# Altium schematic sheet FPGA_NonIO.SchDoc: FPGA Power and Programming
size A4; Organization: Altium Limited.; Address1: Level 3, 12a Rodborough Rd; Address2: Frenchs Forest 2086; Address3: NSW; Address4: AUSTRALIA; DocumentNumber: 7; SheetNumber: 7; SheetTotal: 21; PageSetup: Record=PageOptions|CenterHorizontal=True|CenterVertical=True|PrintScale=0.97|XCorrection=1.00|YCorrection=1.00|PrintKind=2|BorderSize=5000000|LeftOffset=0|BottomOffset=0|Orientation=2|PaperLength=1000|PaperWidth=1000|Scale=100|PaperSource=15|PrintQuality=600|MediaType=1|DitherType=10|PaperKind=A4|PrintScaleMode=1
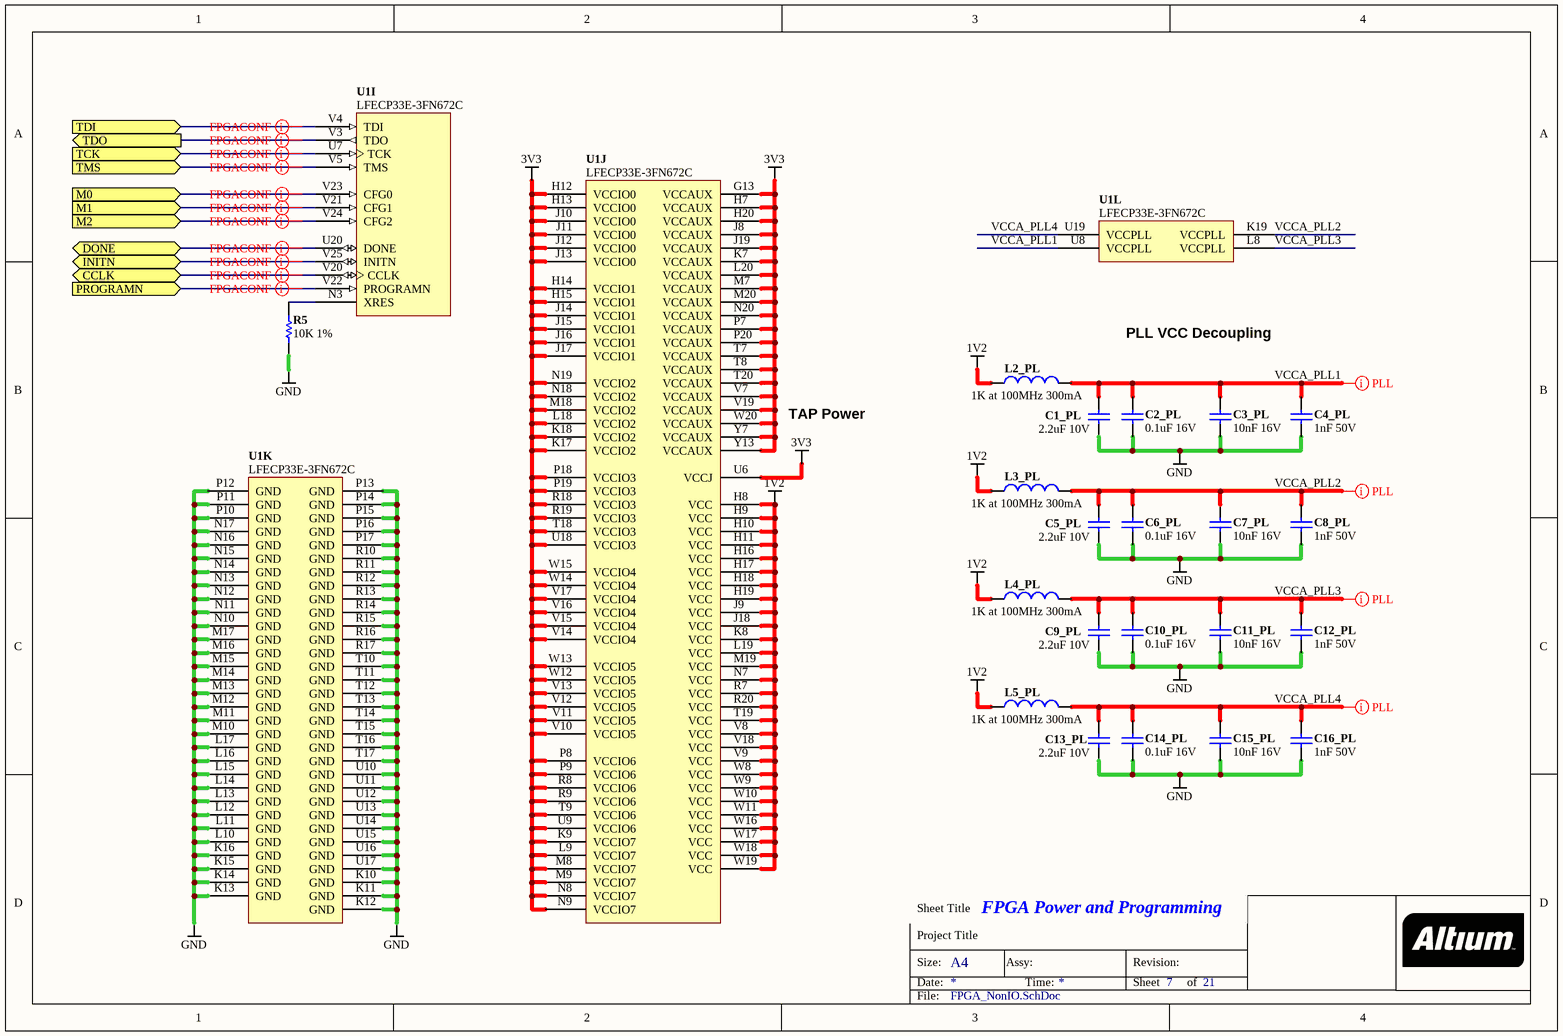
[diagram p0: FPGA_NonIO.SchDoc]

## Parts
C1_PL  2.2uF 10V  [CAPC1608-STAR]
C2_PL  0.1uF 16V  [CAPC1005-STAR]
C3_PL  10nF 16V  [CAPC1005-STAR]
C4_PL  1nF 50V  [CAPC1005-STAR]
C5_PL  2.2uF 10V  [CAPC1608-STAR]
C6_PL  0.1uF 16V  [CAPC1005-STAR]
C7_PL  10nF 16V  [CAPC1005-STAR]
C8_PL  1nF 50V  [CAPC1005-STAR]
C9_PL  2.2uF 10V  [CAPC1608-STAR]
C10_PL  0.1uF 16V  [CAPC1005-STAR]
C11_PL  10nF 16V  [CAPC1005-STAR]
C12_PL  1nF 50V  [CAPC1005-STAR]
C13_PL  2.2uF 10V  [CAPC1608-STAR]
C14_PL  0.1uF 16V  [CAPC1005-STAR]
C15_PL  10nF 16V  [CAPC1005-STAR]
C16_PL  1nF 50V  [CAPC1005-STAR]
L2_PL  1K at 100MHz 300mA  [INDC2012-STAR]
L3_PL  1K at 100MHz 300mA  [INDC2012-STAR]
L4_PL  1K at 100MHz 300mA  [INDC2012-STAR]
L5_PL  1K at 100MHz 300mA  [INDC2012-STAR]
R5  10K 1%  [RESC1005-STAR]
U1  LFECP33E-3FN672C  [BGA100P26X26-672]  (parts I,J,K,L of 12)

## Ports
CCLK (bidir), DONE (bidir), INITN (bidir), M0 (in), M1 (in), M2 (in), PROGRAMN (in), TCK (in), TDI (in), TDO (out), TMS (in)

## Nets
1V2: L2_PL.1 L3_PL.1 L4_PL.1 L5_PL.1 U1.H8(VCC) U1.H9(VCC) U1.H10(VCC) U1.H11(VCC) U1.H16(VCC) U1.H17(VCC) U1.H18(VCC) U1.H19(VCC) U1.J9(VCC) U1.J18(VCC) U1.K8(VCC) U1.L19(VCC) U1.M19(VCC) U1.N7(VCC) U1.R7(VCC) U1.R20(VCC) U1.T19(VCC) U1.V8(VCC) U1.V9(VCC) U1.V18(VCC) U1.W8(VCC) U1.W9(VCC) U1.W10(VCC) U1.W11(VCC) U1.W16(VCC) U1.W17(VCC) U1.W18(VCC) U1.W19(VCC)
3V3: U1.G13(VCCAUX) U1.H7(VCCAUX) U1.H12(VCCIO0) U1.H13(VCCIO0) U1.H14(VCCIO1) U1.H15(VCCIO1) U1.H20(VCCAUX) U1.J8(VCCAUX) U1.J10(VCCIO0) U1.J11(VCCIO0) U1.J12(VCCIO0) U1.J13(VCCIO0) U1.J14(VCCIO1) U1.J15(VCCIO1) U1.J16(VCCIO1) U1.J17(VCCIO1) U1.J19(VCCAUX) U1.K7(VCCAUX) U1.K9(VCCIO7) U1.K17(VCCIO2) U1.K18(VCCIO2) U1.L9(VCCIO7) U1.L18(VCCIO2) U1.L20(VCCAUX) U1.M7(VCCAUX) U1.M8(VCCIO7) U1.M9(VCCIO7) U1.M18(VCCIO2) U1.M20(VCCAUX) U1.N8(VCCIO7) U1.N9(VCCIO7) U1.N18(VCCIO2) U1.N19(VCCIO2) U1.N20(VCCAUX) U1.P7(VCCAUX) U1.P8(VCCIO6) U1.P9(VCCIO6) U1.P18(VCCIO3) U1.P19(VCCIO3) U1.P20(VCCAUX) U1.R8(VCCIO6) U1.R9(VCCIO6) U1.R18(VCCIO3) U1.R19(VCCIO3) U1.T7(VCCAUX) U1.T8(VCCAUX) U1.T9(VCCIO6) U1.T18(VCCIO3) U1.T20(VCCAUX) U1.U6(VCCJ) U1.U9(VCCIO6) U1.U18(VCCIO3) U1.V7(VCCAUX) U1.V10(VCCIO5) U1.V11(VCCIO5) U1.V12(VCCIO5) U1.V13(VCCIO5) U1.V14(VCCIO4) U1.V15(VCCIO4) U1.V16(VCCIO4) U1.V17(VCCIO4) U1.V19(VCCAUX) U1.W12(VCCIO5) U1.W13(VCCIO5) U1.W14(VCCIO4) U1.W15(VCCIO4) U1.W20(VCCAUX) U1.Y7(VCCAUX) U1.Y13(VCCAUX)
GND: C1_PL.2 C2_PL.2 C3_PL.2 C4_PL.2 C5_PL.2 C6_PL.2 C7_PL.2 C8_PL.2 C9_PL.2 C10_PL.2 C11_PL.2 C12_PL.2 C13_PL.2 C14_PL.2 C15_PL.2 C16_PL.2 R5.2 U1.K10(GND) U1.K11(GND) U1.K12(GND) U1.K13(GND) U1.K14(GND) U1.K15(GND) U1.K16(GND) U1.L10(GND) U1.L11(GND) U1.L12(GND) U1.L13(GND) U1.L14(GND) U1.L15(GND) U1.L16(GND) U1.L17(GND) U1.M10(GND) U1.M11(GND) U1.M12(GND) U1.M13(GND) U1.M14(GND) U1.M15(GND) U1.M16(GND) U1.M17(GND) U1.N10(GND) U1.N11(GND) U1.N12(GND) U1.N13(GND) U1.N14(GND) U1.N15(GND) U1.N16(GND) U1.N17(GND) U1.P10(GND) U1.P11(GND) U1.P12(GND) U1.P13(GND) U1.P14(GND) U1.P15(GND) U1.P16(GND) U1.P17(GND) U1.R10(GND) U1.R11(GND) U1.R12(GND) U1.R13(GND) U1.R14(GND) U1.R15(GND) U1.R16(GND) U1.R17(GND) U1.T10(GND) U1.T11(GND) U1.T12(GND) U1.T13(GND) U1.T14(GND) U1.T15(GND) U1.T16(GND) U1.T17(GND) U1.U10(GND) U1.U11(GND) U1.U12(GND) U1.U13(GND) U1.U14(GND) U1.U15(GND) U1.U16(GND) U1.U17(GND)
CCLK: U1.V20(CCLK) ; port CCLK
DONE: U1.U20(DONE) ; port DONE
INITN: U1.V25(INITN) ; port INITN
M0: U1.V23(CFG0) ; port M0
M1: U1.V21(CFG1) ; port M1
M2: U1.V24(CFG2) ; port M2
PROGRAMN: U1.V22(PROGRAMN) ; port PROGRAMN
TCK: U1.U7(TCK) ; port TCK
TDI: U1.V4(TDI) ; port TDI
TDO: U1.V3(TDO) ; port TDO
TMS: U1.V5(TMS) ; port TMS
VCCA_PLL1: C1_PL.1 C2_PL.1 C3_PL.1 C4_PL.1 L2_PL.2 U1.U8(VCCPLL)
VCCA_PLL2: C5_PL.1 C6_PL.1 C7_PL.1 C8_PL.1 L3_PL.2 U1.K19(VCCPLL)
VCCA_PLL3: C9_PL.1 C10_PL.1 C11_PL.1 C12_PL.1 L4_PL.2 U1.L8(VCCPLL)
VCCA_PLL4: C13_PL.1 C14_PL.1 C15_PL.1 C16_PL.1 L5_PL.2 U1.U19(VCCPLL)
NetR5_1: R5.1 U1.N3(XRES)

## Layout directives
net class FPGACONF: CCLK, DONE, INITN, M0, M1, M2, PROGRAMN, TCK, TDI, TDO, TMS
net class PLL: VCCA_PLL1, VCCA_PLL2, VCCA_PLL3, VCCA_PLL4

## Notes on the sheet
- PLL VCC Decoupling
- TAP Power
- Sheet Title
- Project Title
- Size:
- Date:
- A4
- Assy:
- Time:
- Revision:
- Sheet
- of
- File:

## Library data of the parts
C1_PL C5_PL C9_PL C13_PL = D-101-0095: Capacitor, Ceramic, 2.2uF 10% 10V 0603 (1608) X5R; Polarity: Non-Polarized; Capacitance: 2.2 uF; Dielectric: X5R; Mounting Technology: Surface Mount; Rated Voltage: 10 V; Status: Unreleased; Technology: Ceramic; Tolerance: 10 %; Category: Capacitor
C2_PL C6_PL C10_PL C14_PL = D-101-0080: Capacitor, Ceramic, 0.1uF 10% 16V 0402 (1005) X7R; Polarity: Non-Polarized; Capacitance: 0.1 uF; Dielectric: X7R; Mounting Technology: Surface Mount; Rated Voltage: 16 V; Status: Production; Technology: Ceramic; Tolerance: 10 %; Category: Capacitor
C3_PL C7_PL C11_PL C15_PL = D-101-0077: Capacitor, Ceramic, 10nF 10% 16V 0402 (1005) X7R; Polarity: Non-Polarized; Capacitance: 10 nF; Dielectric: X7R; Mounting Technology: Surface Mount; Rated Voltage: 16 V; Status: Production; Technology: Ceramic; Tolerance: 10 %; Category: Capacitor
C4_PL C8_PL C12_PL C16_PL = D-101-0030: Capacitor, Ceramic, 1nF 10% 50V 0402 (1005) X7R; Polarity: Non-Polarized; Capacitance: 1 nF; Dielectric: X7R; Mounting Technology: Surface Mount; Rated Voltage: 50 V; Status: Production; Technology: Ceramic; Tolerance: 10 %; Category: Capacitor
L2_PL L3_PL L4_PL L5_PL = D-102-0002: Inductor, Ferrite Bead 1K@100MHz 300mA 0805 (2012) BMB2A1000LN2; Inductance: nH; Max Input Current: 300 mA; Mounting Technology: Surface Mount; Status: Production; Category: Inductor
R5 = D-100-0130: Resistor, 10K 1% 0402 (1005); Power Rating: 63 mW; Mounting Technology: Surface Mount; Resistance: 10 K; Status: Production; Tolerance: 1 %; Category: Resistor
U1 = D-241-0003: FPGA, Lattice ECP-35 FN672; Supply Voltage: mV; Mounting Technology: Surface Mount; Status: Production; Technology: None; Category: IC-FPGA